# EAGLE schematic jlpcb-096 (EAGLE 5.11)
ABBREV: ec1; PROJECT: Ethernet Card
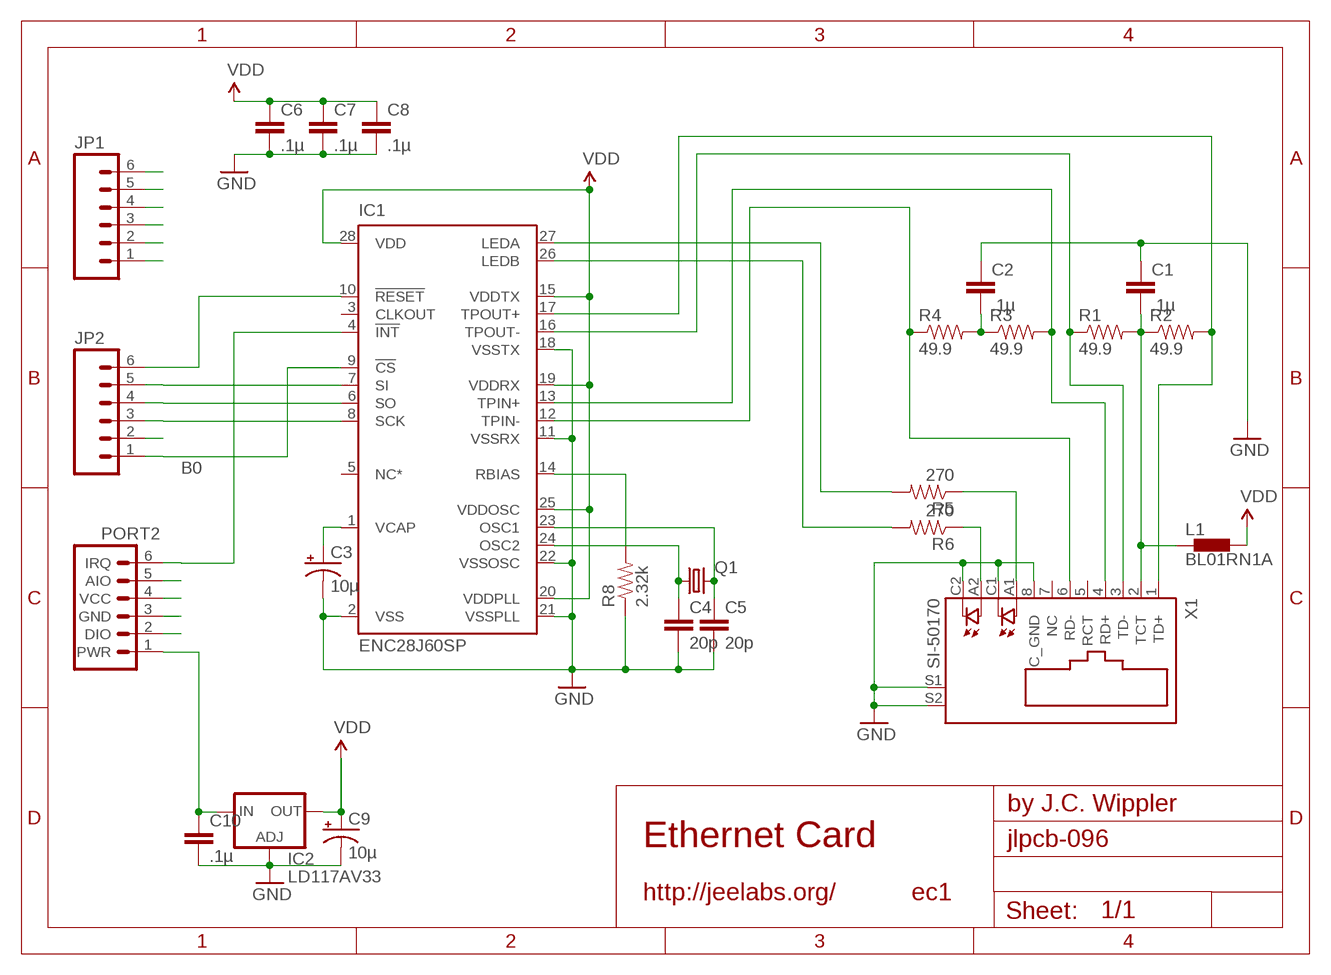
[diagram p0: schematic, sheet 1]

## Parts
C1  .1µ  CAPPTH  [CAP-PTH-SMALL]
C2  .1µ  CAPPTH  [CAP-PTH-SMALL]
C3  10µ  CAP_POLPTH2  [CPOL-RADIAL-10UF-25V]
C4  20p  CAPPTH  [CAP-PTH-SMALL]
C5  20p  CAPPTH  [CAP-PTH-SMALL]
C6  .1µ  CAPPTH  [CAP-PTH-SMALL]
C7  .1µ  CAPPTH  [CAP-PTH-SMALL]
C8  .1µ  CAPPTH  [CAP-PTH-SMALL]
C9  10µ  CAP_POLPTH2  [CPOL-RADIAL-10UF-25V]
C10  .1µ  CAPPTH  [CAP-PTH-SMALL]
IC1  ENC28J60SP  [DIL28-3]
IC2  LD117AV33  [TO220L1]
JP1  M06LOCK_LONGPADS  [1X06_LOCK_LONGPADS]
JP2  M06LOCK_LONGPADS  [1X06_LOCK_LONGPADS]
L1  BL01RN1A  [BL01RN1A]
PORT2  JEEPORT-LONGPADS  [PORT6PIN]
Q1  CRYSTALHC49US  [HC49US]
R1  49.9  RESISTORPTH1  [AXIAL-0.3]
R2  49.9  RESISTORPTH1  [AXIAL-0.3]
R3  49.9  RESISTORPTH1  [AXIAL-0.3]
R4  49.9  RESISTORPTH1  [AXIAL-0.3]
R5  270  RESISTORPTH1  [AXIAL-0.3]
R6  270  RESISTORPTH1  [AXIAL-0.3]
R8  2.32k  RESISTORPTH1  [AXIAL-0.3]
X1  SI-50170  [SI-50170]

## Nets
AIO3: JP1.3
B0: IC1.9(!CS) JP2.1
B1: JP2.2
DIO3: JP1.4
GND [power]: C1.1 C2.1 C3.2(-) C4.2 C5.2 C6.2 C7.2 C8.2 C9.2(-) C10.2 IC1.2(VSS) IC1.11(VSSRX) IC1.18(VSSTX) IC1.21(VSSPLL) IC1.22(VSSOSC) IC2.1(ADJ) PORT2.3(GND) R8.P$1 X1.8(C_GND) X1.C1(C) X1.C2(C1) X1.S1 X1.S2
MISO: IC1.6(SO) JP2.4
MOSI: IC1.7(SI) JP2.5
N$2: C3.1(+) IC1.1(VCAP)
N$3: IC1.14(RBIAS) R8.P$2
N$4 [power]: C4.1 IC1.24(OSC2) Q1.1
N$5 [power]: C5.1 IC1.23(OSC1) Q1.2
N$8 [power]: C2.2 R3.P$1 R4.P$2
N$13: IC1.4(!INT) PORT2.6(IRQ)
N$14: PORT2.2(DIO)
N$15 [power]: C1.2 L1.1 R1.P$2 R2.P$1 X1.2(TCT)
N$17 [power]: IC1.17(TPOUT+) R2.P$2 X1.1(TD+)
N$18: PORT2.5(AIO)
N$19 [power]: IC1.16(TPOUT-) R1.P$1 X1.3(TD-)
N$20 [power]: IC1.13(TPIN+) R3.P$2 X1.4(RD+)
N$21 [power]: IC1.12(TPIN-) R4.P$1 X1.6(RD-)
N$23: R5.P$1 X1.A1(A)
N$24: R6.P$1 X1.A2(A1)
N$26: IC1.26(LEDB) R6.P$2
N$27: IC1.27(LEDA) R5.P$2
PWR [power]: C10.1 IC2.3(IN) PORT2.1(PWR)
RST: IC1.10(!RESET) JP2.6
RXD: JP1.1
SCK: IC1.8(SCK) JP2.3
SCL: JP1.5
SDA: JP1.6
TXD: JP1.2
VCC [power]: PORT2.4(VCC)
VDD [power]: C6.1 C7.1 C8.1 C9.1(+) IC1.15(VDDTX) IC1.19(VDDRX) IC1.20(VDDPLL) IC1.25(VDDOSC) IC1.28(VDD) IC2.2(OUT) L1.2
Unconnected: IC1.3(CLKOUT) IC1.5(NC*) X1.5(RCT) X1.7(NC)

## Library data of the parts
C1 C2 C4-C8 C10 = SparkFun:CAP: Capacitor Standard 0603 ceramic capacitor, and 0.1" leaded capacitor.
C3 C9 = SparkFun:CAP_POL: Capacitor Polarized These are standard SMD and PTH capacitors. Normally 10uF, 47uF, and 100uF in electrolytic and tantalum varieties. Always verify the external diameter of the through hole cap, it varies with capacity, voltage, and manufacturer. The EIA devices should be standard.
IC1 = microchip:ENC28J60: Stand-Alone Ethernet Controller with SPI Interface Source: http://ww1.microchip.com/downloads/en/DeviceDoc/39662c.pdf
IC2 = v-reg:LD117A?*: Low drop fixed and adjustable positive voltage regulators 1 A Source: http://www.st.com/stonline/products/literature/ds/7194/ld1117axx.pdf
JP1 JP2 = SparkFun:M06: Header 6 Standard 6-pin 0.1" header. Use with straight break away headers (SKU : PRT-00116), right angle break away headers (PRT-00553), swiss pins (PRT-00743), machine pins (PRT-00117), and female headers (PRT-00115). Molex polarized connector foot print use with SKU : PRT-08094 with associated crimp pins and housings. NOTES ON THE VARIANTS LOCK and LOCK_LONGPADS... This footprint was designed to help hold the alignment of a through-hole component (i.e. 6-pin header) while soldering it into place. You may notice that each hole has been shifted either up or down by 0.005 of an inch from it's more standard position (which is a perfectly straight line). This slight alteration caused the pins (the squares in the middle) to touch the edges of the holes. Because they are alternating, it causes a "brace" to hold the component in place. 0.005 has proven to be the perfect amount of "off-center" position when using our standard breakaway headers. Although looks a little odd when you look at the bare footprint, once you have a header in there, the alteration is very hard to notice. Also, if you push a header all the way into place, it is covered up entirely on the bottom side. This idea of altering the position of holes to aid alignment will be further integrated into the Sparkfun Library for other footprints. It can help hold any component with 3 or more connection pins.
L1 = inductors:BL0: Noise Suppression Products/EMI Suppression Filters, Lead EMIFIL(R) Inductor Type Source: http://www.murata.com .. BL01RN1_DS.pdf
PORT2 = JeeLabs:JEEPORT: PIN HEADER
Q1 = SparkFun:CRYSTAL: Crystals Various standard crystals. Proven footprints. Spark Fun Electronics SKU : COM-00534
R1-R6 R8 = SparkFun:RESISTOR: Resistor Basic schematic elements and footprints for 0603, 1206, and PTH 1/10th watt (small) resistors.
X1 = con-stewart:SI-50170: Ethernet Connector MagJack (R) Source: www.stewartconnector.com .. si-50170.pdf

## Net classes
0 default: width 0.203 mm
1 power: width 0.381 mm